# Altium schematic sheet A1.0-电源-1.0-简易电源220V转12V.SchDoc
size A4
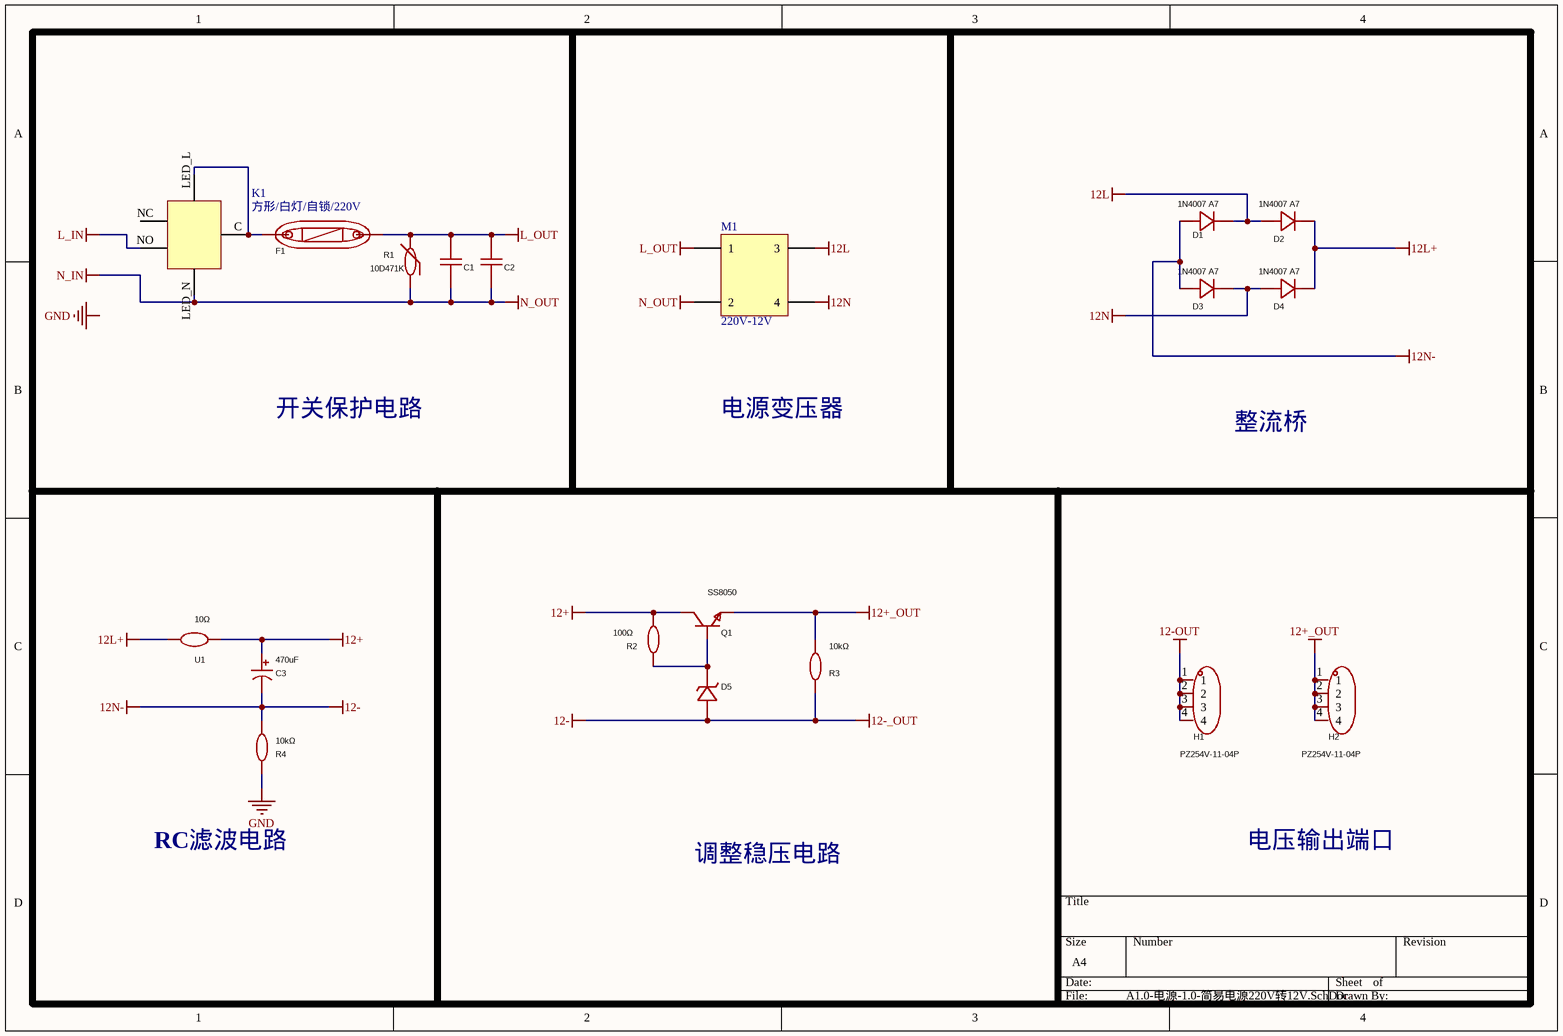
[diagram p0: A1.0-电源-1.0-简易电源220V转12V.SchDoc]

## Parts
C1  470nF  [CAP-TH_L18.0-W8.5-P15.00-D0.8]  (value not drawn)
C2  100nF  [CAP-TH_L18.0-W6.0-P15.00-D0.8]  (value not drawn)
C3  470uF  [CAP-SMD_BD10.0-L10.3-W10.3-LS11.0-R-RD]
D1  1N4007 A7  [SOD-123FL_L2.8-W1.8-LS3.7-RD]
D2  1N4007 A7  [SOD-123FL_L2.8-W1.8-LS3.7-RD]
D3  1N4007 A7  [SOD-123FL_L2.8-W1.8-LS3.7-RD]
D4  1N4007 A7  [SOD-123FL_L2.8-W1.8-LS3.7-RD]
D5  1SMAF4742A-MS  [SMAF_L3.5-W2.6-LS4.7-RD]  (value not drawn)
F1  保险丝透明座  [FUSE-TH_L24.5-W9.8-P22.5]  (value not drawn)
H1  PZ254V-11-04P  [HDR-TH_4P-P2.54-V-M]
H2  PZ254V-11-04P  [HDR-TH_4P-P2.54-V-M]
K1  方形/白灯/自锁/220V  [方形/白灯/自锁/220V]
M1  220V-12V  [220v-12v]
Q1  SS8050  [SOT-23-3_L2.9-W1.3-P1.90-LS2.4-BR]
R1  10D471K  [RES-TH_L12.5-W6.7-P7.50-D1.2]
R2  100Ω  [R0805]
R3  10kΩ  [R0805]
R4  10kΩ  [R0805]
U1  10Ω  [RES-TH_L22.0-W10.0-P26.00-D1.0]

## Nets
12+: C3.1 Q1.3(C) R2.2 U1.2
12+_OUT: H2.1 H2.2 H2.3 H2.4 Q1.2(E) R3.1
12-: C3.2 D1.2(A) D3.2(A) D5.2(A) R3.2 R4.2  [also labelled 12-_OUT, 12N-]
12-OUT: H1.1 H1.2 H1.3 H1.4
12L: D1.1(K) D2.2(A) M1.3
12L+: D2.1(K) D4.1(K) U1.1
12N: D3.1(K) D4.2(A) M1.4
GND: R4.1
L_IN: K1.NO
L_OUT: C1.2 C2.2 F1.2 M1.1 R1.2
N_IN: C1.1 C2.1 K1.LED_N M1.2 R1.1  [also labelled N_OUT]
NetD5_1: D5.1(K) Q1.1(B) R2.1
NetF1_1: F1.1 K1.C K1.LED_L

Not connected (* = marked no-connect by the designer): K1 NC(1)

## Notes on the sheet
- 开关保护电路
- 电源变压器
- 整流桥
- RC滤波电路
- 电压输出端口
- 调整稳压电路
- Labels drawn without touching a wire or pin: GND

## Library data of the parts
C1 = MPX474K31D4KN15800: Manufacturer: KNSCHA(科尼盛); Add into BOM: yes; Tolerance: ±10%; Voltage(AC): 275V；310V；305V; Subclass: X2; safety certification: UL；CUL；KC；ENEC；VDE；CQC; Symbol: MPX474K31D4KN15800; Device: MPX474K31D4KN15800; LCSC Part Name: 470nF ±10% 275V 305V 310V 等级:X2; Supplier Part: C489083; Manufacturer Part: MPX474K31D4KN15800; Supplier Footprint: 插件,P=15mm; JLCPCB Part Class: Extended Part; Datasheet: https://atta.szlcsc.com/upload/public/pdf/source/20200225/C489083_F6E19227418858FC365C5FE899E9F354.pdf; Supplier: LCSC; Convert to PCB: yes; Value: 470nF; Operating Temperature: -40℃~+110℃; Comment_1: 470nF
C2 = MPX104K31D2KN15800: Manufacturer: KNSCHA(科尼盛); Add into BOM: yes; Tolerance: ±10%; Voltage(AC): 275V；310V；305V; Subclass: X2; safety certification: UL；CUL；KC；ENEC；VDE；CQC; Symbol: MPX104K31D2KN15800; Device: MPX104K31D2KN15800; LCSC Part Name: 100nF ±10% 275V 305V 310V 等级:X2; Supplier Part: C489085; Manufacturer Part: MPX104K31D2KN15800; Supplier Footprint: 插件,P=15mm; JLCPCB Part Class: Extended Part; Datasheet: https://atta.szlcsc.com/upload/public/pdf/source/20200225/C489085_A20AE97359BB085300A3488D2C19B548.pdf; Supplier: LCSC; Convert to PCB: yes; Value: 100nF; Operating Temperature: -40℃~+110℃; Comment_1: 100nF
C3 = RVT1V471M1010_C72519: Manufacturer: ROQANG(容强); Symbol: RVT1V471M1010-C72519; Add into BOM: yes; Tolerance: ±20%; Rated Voltage: 35V; Ripple Current: 286mA@120Hz; φD: 10mm; L: 10.2mm; Lifetime @ Temp: 2000hrs@105℃; Device: RVT1V471M1010_C72519; LCSC Part Name: 470uF ±20% 35V; Supplier Part: C72519; Manufacturer Part: RVT1V471M1010; Supplier Footprint: SMD,D10xL10.2mm; JLCPCB Part Class: Extended Part; Datasheet: https://atta.szlcsc.com/upload/public/pdf/source/20210128/C72519_A1B8ED607B11AD36B70B1D23AFC8819E.pdf; Supplier: LCSC; Convert to PCB: yes; Value: 470uF; Equivalent Series Resistance(ESR): -; Operating Temperature: -40℃~+105℃; Comment_1: 470uF
D1-D4 = 1N4007 A7: Manufacturer: MSKSEMI(美森科); Add into BOM: yes; Forward Voltage (Vf@If): 1V@1A; Reverse Voltage (Vr): 1kV; Rectified Current: 1A; Reverse Leakage Current: 10uA@1kV; Symbol: 1N4007 A7; Device: 1N4007 A7; LCSC Part Name: 电压:1kV 电流:1A; Supplier Part: C2902912; Manufacturer Part: 1N4007 A7; Supplier Footprint: SOD-123FL; JLCPCB Part Class: Extended Part; Datasheet: https://atta.szlcsc.com/upload/public/pdf/source/20240508/1829C9D8507EFBB572682FFAB90585C9.pdf; Supplier: LCSC; Convert to PCB: yes; Diode Configuration: -; Comment_1: 1N4007 A7
D5 = 1SMAF4742A-MS: Manufacturer: MSKSEMI(美森科); Add into BOM: yes; Diode Configuration: 独立式; Zener Voltage (Nom): 12V; Zener Voltage (Range): 11.4V~12.6V; Power Dissipation: 1W; Symbol: 1SMAF4742A-MS; Device: 1SMAF4742A-MS; LCSC Part Name: 1SMAF4742A-MS; Supplier Part: C7473188; Manufacturer Part: 1SMAF4742A-MS; Supplier Footprint: SMAF; JLCPCB Part Class: Extended Part; Datasheet: https://atta.szlcsc.com/upload/public/pdf/source/20230808/961209BA8BFD5E8DA2D4013966AF49BD.pdf; Supplier: LCSC; Convert to PCB: yes; Comment_1: 1SMAF4742A-MS
F1 = 保险丝透明座: Manufacturer: xcfuse(旭程); Symbol: Fuse transparent seat; Add into BOM: yes; Device: 保险丝透明座; LCSC Part Name: 保险丝座 5*20 透明座(两件套); Supplier Part: C58066; Manufacturer Part: 保险丝透明座; Supplier Footprint: -; JLCPCB Part Class: Extended Part; Datasheet: https://atta.szlcsc.com/upload/public/pdf/source/20201109/C58066_EF84FEEE40948BE1BD26BCA72E4FE443.pdf; Supplier: LCSC; Convert to PCB: yes; Fuseholder Type: -; Fuse Type: -; Fuse Size: -; Comment_1: 保险丝透明座
H1 H2 = PZ254V-11-04P: Manufacturer: XFCN(兴飞); Symbol: PZ254V-11-04P_C2691448; Add into BOM: yes; Pin Structure: 1x4P; Pitch: 2.54mm; Circluar Pins/Square Pins: 方针; Current Rating (Max): 3A; Voltage Rating (Max): 250V; Device: PZ254V-11-04P; LCSC Part Name: 间距:2.54mm 1x4P 直插 方针; Supplier Part: C2691448; Manufacturer Part: PZ254V-11-04P; Supplier Footprint: 插件,P=2.54mm; JLCPCB Part Class: Extended Part; Datasheet: https://atta.szlcsc.com/upload/public/pdf/source/20200309/C492403_F9F19131791D08044AD4F84F8E751A34.pdf; Supplier: LCSC; Convert to PCB: yes; Row Spacing: -; Mounting Type: 直插; Number of Rows: 单排; Number of Pins: 4P; Length of Mating Pin: 6mm; Insulation Height: 2.5mm; Length of End Connection Pin: 3mm; Contact Material: -; Operating Temperature Range: -40℃~+105℃; Color: 黑色; Comment_1: PZ254V-11-04P
M1 = 220v转12v电源变压器
Q1 = SS8050_C2150: Manufacturer: CJ(江苏长电/长晶); Add into BOM: yes; Transistor Type: NPN; Collector Current (Ic): 1.5A; Collector-Emitter Breakdown Voltage (Vceo): 25V; Power Dissipation (Pd): 300mW; DC Current Gain (hFE@Ic,Vce): 200@100mA,1V; Transition Frequency (fT): 100MHz; Collector Cut-Off Current (Icbo): 100nA; Collector-Emitter Saturation Voltage (VCE(sat)@Ic,Ib): 500mV@800mA,80mA; Symbol: SS8050_C2150; Device: SS8050_C2150; LCSC Part Name: SS8050(RANGE:200-350) hfe=200~350; Supplier Part: C2150; Manufacturer Part: SS8050; Supplier Footprint: SOT-23; JLCPCB Part Class: Basic Part; Datasheet: https://atta.szlcsc.com/upload/public/pdf/source/20230322/AEE86F4B043774EFF80CAEA14A37D9E9.pdf; Supplier: LCSC; Convert to PCB: yes; Operating Temperature: -; Comment_1: SS8050
R1 = 10D471K_C8760: Manufacturer: RUILON(瑞隆源); Symbol: 10D471K-C8760; Add into BOM: yes; Varistor Voltage: 423V~517V; Clamping Voltage: 775V; Allowable Voltage (DC): 385V; Allowable Voltage (AC): 300V; Peak Current: 2.5kA; Maximum Energy: 42.3J; Typical Capatitance: 190pF@1kHz; Device: 10D471K_C8760; LCSC Part Name: 钳位电压775V 42.3焦耳 插件压敏电阻; Supplier Part: C8760; Manufacturer Part: 10D471K; Supplier Footprint: 插件; JLCPCB Part Class: Extended Part; Datasheet: https://atta.szlcsc.com/upload/public/pdf/source/20160725/1469440740918.pdf; Supplier: LCSC; Convert to PCB: yes; Comment_1: 10D471K
R2 = 0805W8F1000T5E: Manufacturer: UNI-ROYAL(厚声); Add into BOM: yes; Tolerance: ±1%; Power(Watts): 125mW; Overload Voltage (Max): 150V; Temperature Coefficient: ±100ppm/℃; Symbol: 0805W8F1000T5E; Device: 0805W8F1000T5E; LCSC Part Name: 100Ω ±1% 125mW 厚膜电阻; Supplier Part: C17408; Manufacturer Part: 0805W8F1000T5E; Supplier Footprint: 0805; JLCPCB Part Class: Basic Part; Datasheet: https://atta.szlcsc.com/upload/public/pdf/source/20200306/C422600_1E6D84923E4A46A82E41ADD87F860B5C.pdf; Supplier: LCSC; Convert to PCB: yes; Type: 厚膜电阻; Value: 100Ω; Operating Temperature Range: -55℃~+155℃; Comment_1: 100Ω
R3 R4 = 0805W8J0103T5E: Manufacturer: UNI-ROYAL(厚声); Add into BOM: yes; Tolerance: ±5%; Power(Watts): 125mW; Overload Voltage (Max): 150V; Temperature Coefficient: ±100ppm/℃; Symbol: 0805W8J0103T5E; Device: 0805W8J0103T5E; LCSC Part Name: 10kΩ ±5% 125mW 厚膜电阻; Supplier Part: C25612; Manufacturer Part: 0805W8J0103T5E; Supplier Footprint: 0805; JLCPCB Part Class: Extended Part; Datasheet: https://atta.szlcsc.com/upload/public/pdf/source/20200306/C422600_1E6D84923E4A46A82E41ADD87F860B5C.pdf; Supplier: LCSC; Convert to PCB: yes; Type: 厚膜电阻; Value: 10kΩ; Operating Temperature Range: -55℃~+155℃; Comment_1: 10kΩ
U1 = SQP5W-10Ω±5%-9P: Manufacturer: VO(翔胜); Add into BOM: yes; Tolerance: ±5%; Overload Voltage (Max): 500V; Power(Watts): 5W; Symbol: SQP5W-10Ω±5%-9P; Device: SQP5W-10Ω±5%-9P; LCSC Part Name: 水泥电阻 10Ω ±5% 5W; Supplier Part: C5808012; Manufacturer Part: SQP5W-10Ω±5%-9P; Supplier Footprint: 插件,22x10mm; JLCPCB Part Class: Extended Part; Datasheet: https://atta.szlcsc.com/upload/public/pdf/source/20240716/CD3D246B71A98560C2D1D89FE25431FC.pdf; Supplier: LCSC; Convert to PCB: yes; Type: 水泥电阻; Value: 10Ω; Operating Temperature Range: -55℃~+155℃; Comment_1: 10Ω